# EAGLE schematic power (EAGLE 6.4)
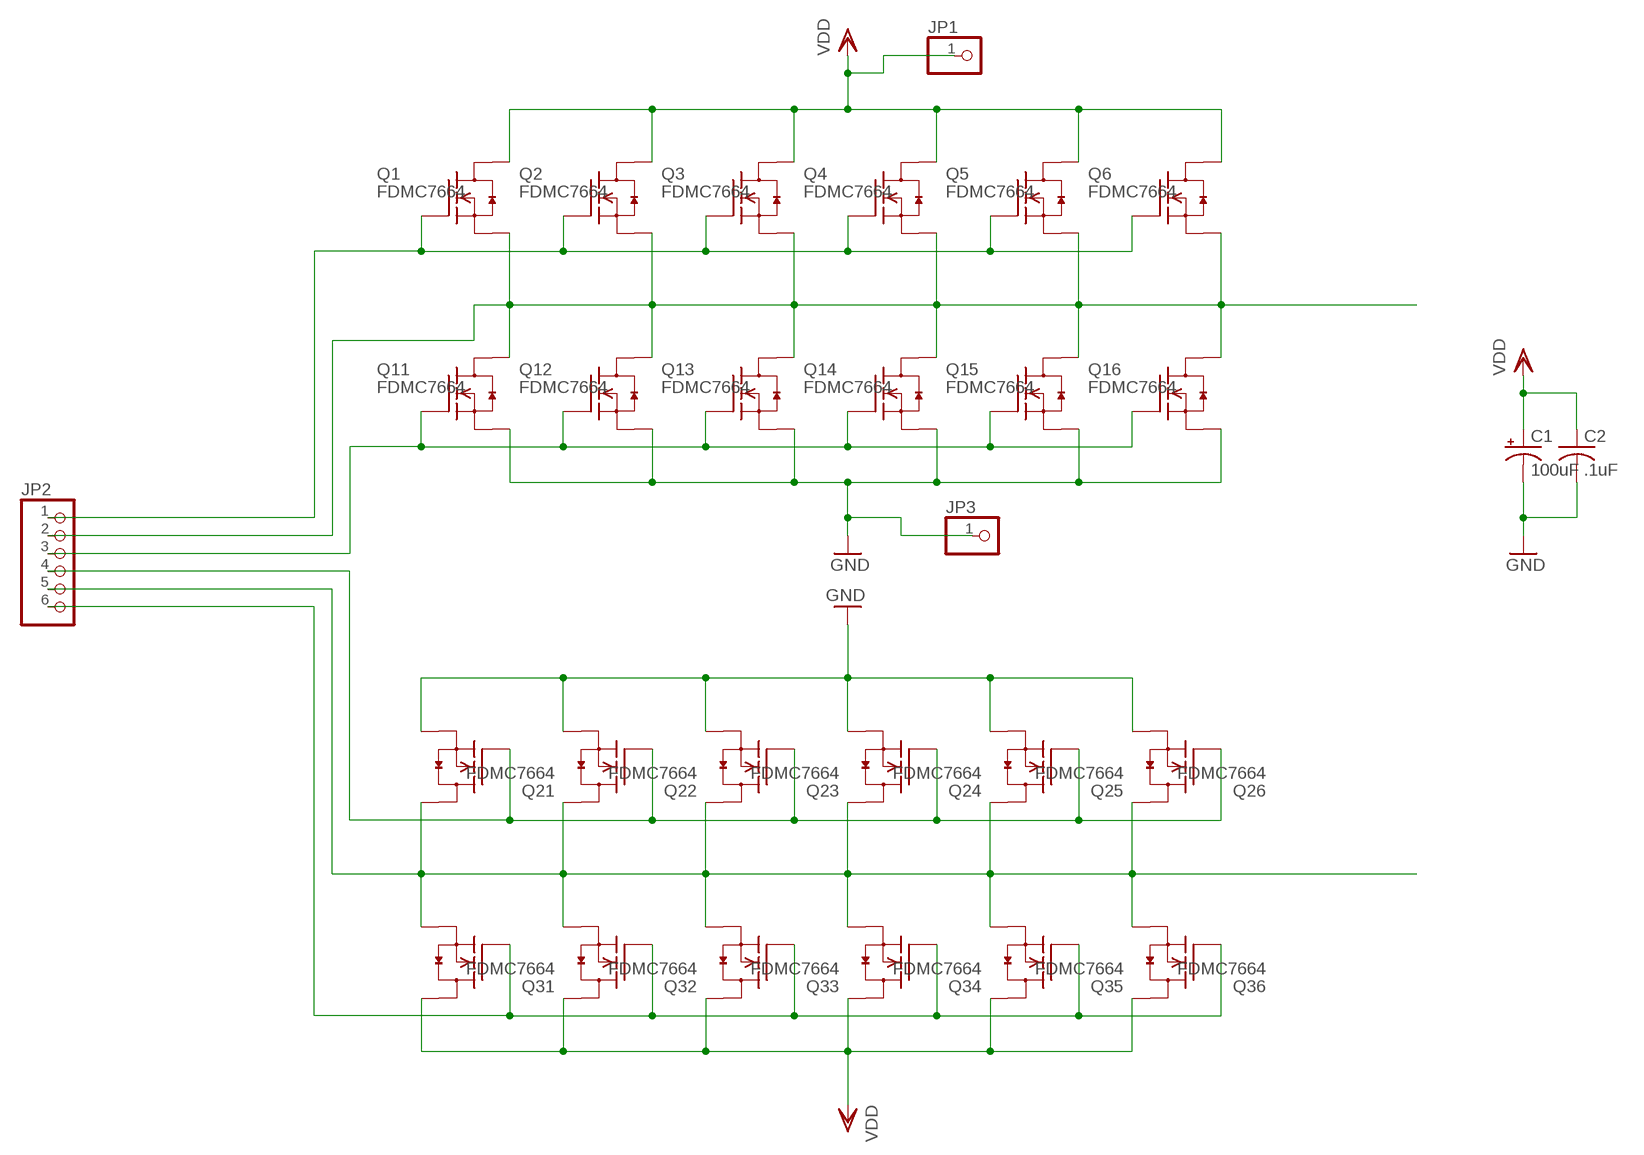
[diagram p0: schematic, sheet 1]

## Parts
C1  100uF  CPOL-US140CLH-0810  [140CLH-0810]
C2  .1uF  C-USC0603  [C0603]
JP1  PINHD-1X1  [1X01]
JP2  PINHD-1X6  [1X06]
JP3  PINHD-1X1  [1X01]
Q1  FDMC7664  [MLP33]
Q2  FDMC7664  [MLP33]
Q3  FDMC7664  [MLP33]
Q4  FDMC7664  [MLP33]
Q5  FDMC7664  [MLP33]
Q6  FDMC7664  [MLP33]
Q11  FDMC7664  [MLP33]
Q12  FDMC7664  [MLP33]
Q13  FDMC7664  [MLP33]
Q14  FDMC7664  [MLP33]
Q15  FDMC7664  [MLP33]
Q16  FDMC7664  [MLP33]
Q21  FDMC7664  [MLP33]
Q22  FDMC7664  [MLP33]
Q23  FDMC7664  [MLP33]
Q24  FDMC7664  [MLP33]
Q25  FDMC7664  [MLP33]
Q26  FDMC7664  [MLP33]
Q31  FDMC7664  [MLP33]
Q32  FDMC7664  [MLP33]
Q33  FDMC7664  [MLP33]
Q34  FDMC7664  [MLP33]
Q35  FDMC7664  [MLP33]
Q36  FDMC7664  [MLP33]

## Nets
GND: C1.- C2.2 JP3.1 Q11.123S(S) Q12.123S(S) Q13.123S(S) Q14.123S(S) Q15.123S(S) Q16.123S(S) Q21.123S(S) Q22.123S(S) Q23.123S(S) Q24.123S(S) Q25.123S(S) Q26.123S(S)
HO_1: JP2.1 Q1.4G(G) Q2.4G(G) Q3.4G(G) Q4.4G(G) Q5.4G(G) Q6.4G(G)
HO_2: JP2.6 Q31.4G(G) Q32.4G(G) Q33.4G(G) Q34.4G(G) Q35.4G(G) Q36.4G(G)
LO_1: JP2.3 Q11.4G(G) Q12.4G(G) Q13.4G(G) Q14.4G(G) Q15.4G(G) Q16.4G(G)
LO_2: JP2.4 Q21.4G(G) Q22.4G(G) Q23.4G(G) Q24.4G(G) Q25.4G(G) Q26.4G(G)
MOTOR_OUT_1: JP2.2 Q1.123S(S) Q2.123S(S) Q3.123S(S) Q4.123S(S) Q5.123S(S) Q6.123S(S) Q11.5678D(D) Q12.5678D(D) Q13.5678D(D) Q14.5678D(D) Q15.5678D(D) Q16.5678D(D)
MOTOR_OUT_2: JP2.5 Q21.5678D(D) Q22.5678D(D) Q23.5678D(D) Q24.5678D(D) Q25.5678D(D) Q26.5678D(D) Q31.123S(S) Q32.123S(S) Q33.123S(S) Q34.123S(S) Q35.123S(S) Q36.123S(S)
VDD: C1.+ C2.1 JP1.1 Q1.5678D(D) Q2.5678D(D) Q3.5678D(D) Q4.5678D(D) Q5.5678D(D) Q6.5678D(D) Q31.5678D(D) Q32.5678D(D) Q33.5678D(D) Q34.5678D(D) Q35.5678D(D) Q36.5678D(D)

## Library data of the parts
C1 = rcl:CPOL-US: POLARIZED CAPACITOR, American symbol
C2 = rcl:C-US: CAPACITOR, American symbol
JP1 JP3 = pinhead:PINHD-1X1: PIN HEADER
JP2 = pinhead:PINHD-1X6: PIN HEADER
Q1-Q6 Q11-Q16 Q21-Q26 Q31-Q36 = open-bldc:FDMC7664